# EasyEDA schematic Spring+Schematic_r1.1_easyeda.json
TITLE: Spring+ Avionics Control-Board; REV: 1.1; Date: 2021-11-15; Sheet: 1/1; Company: Lrocket
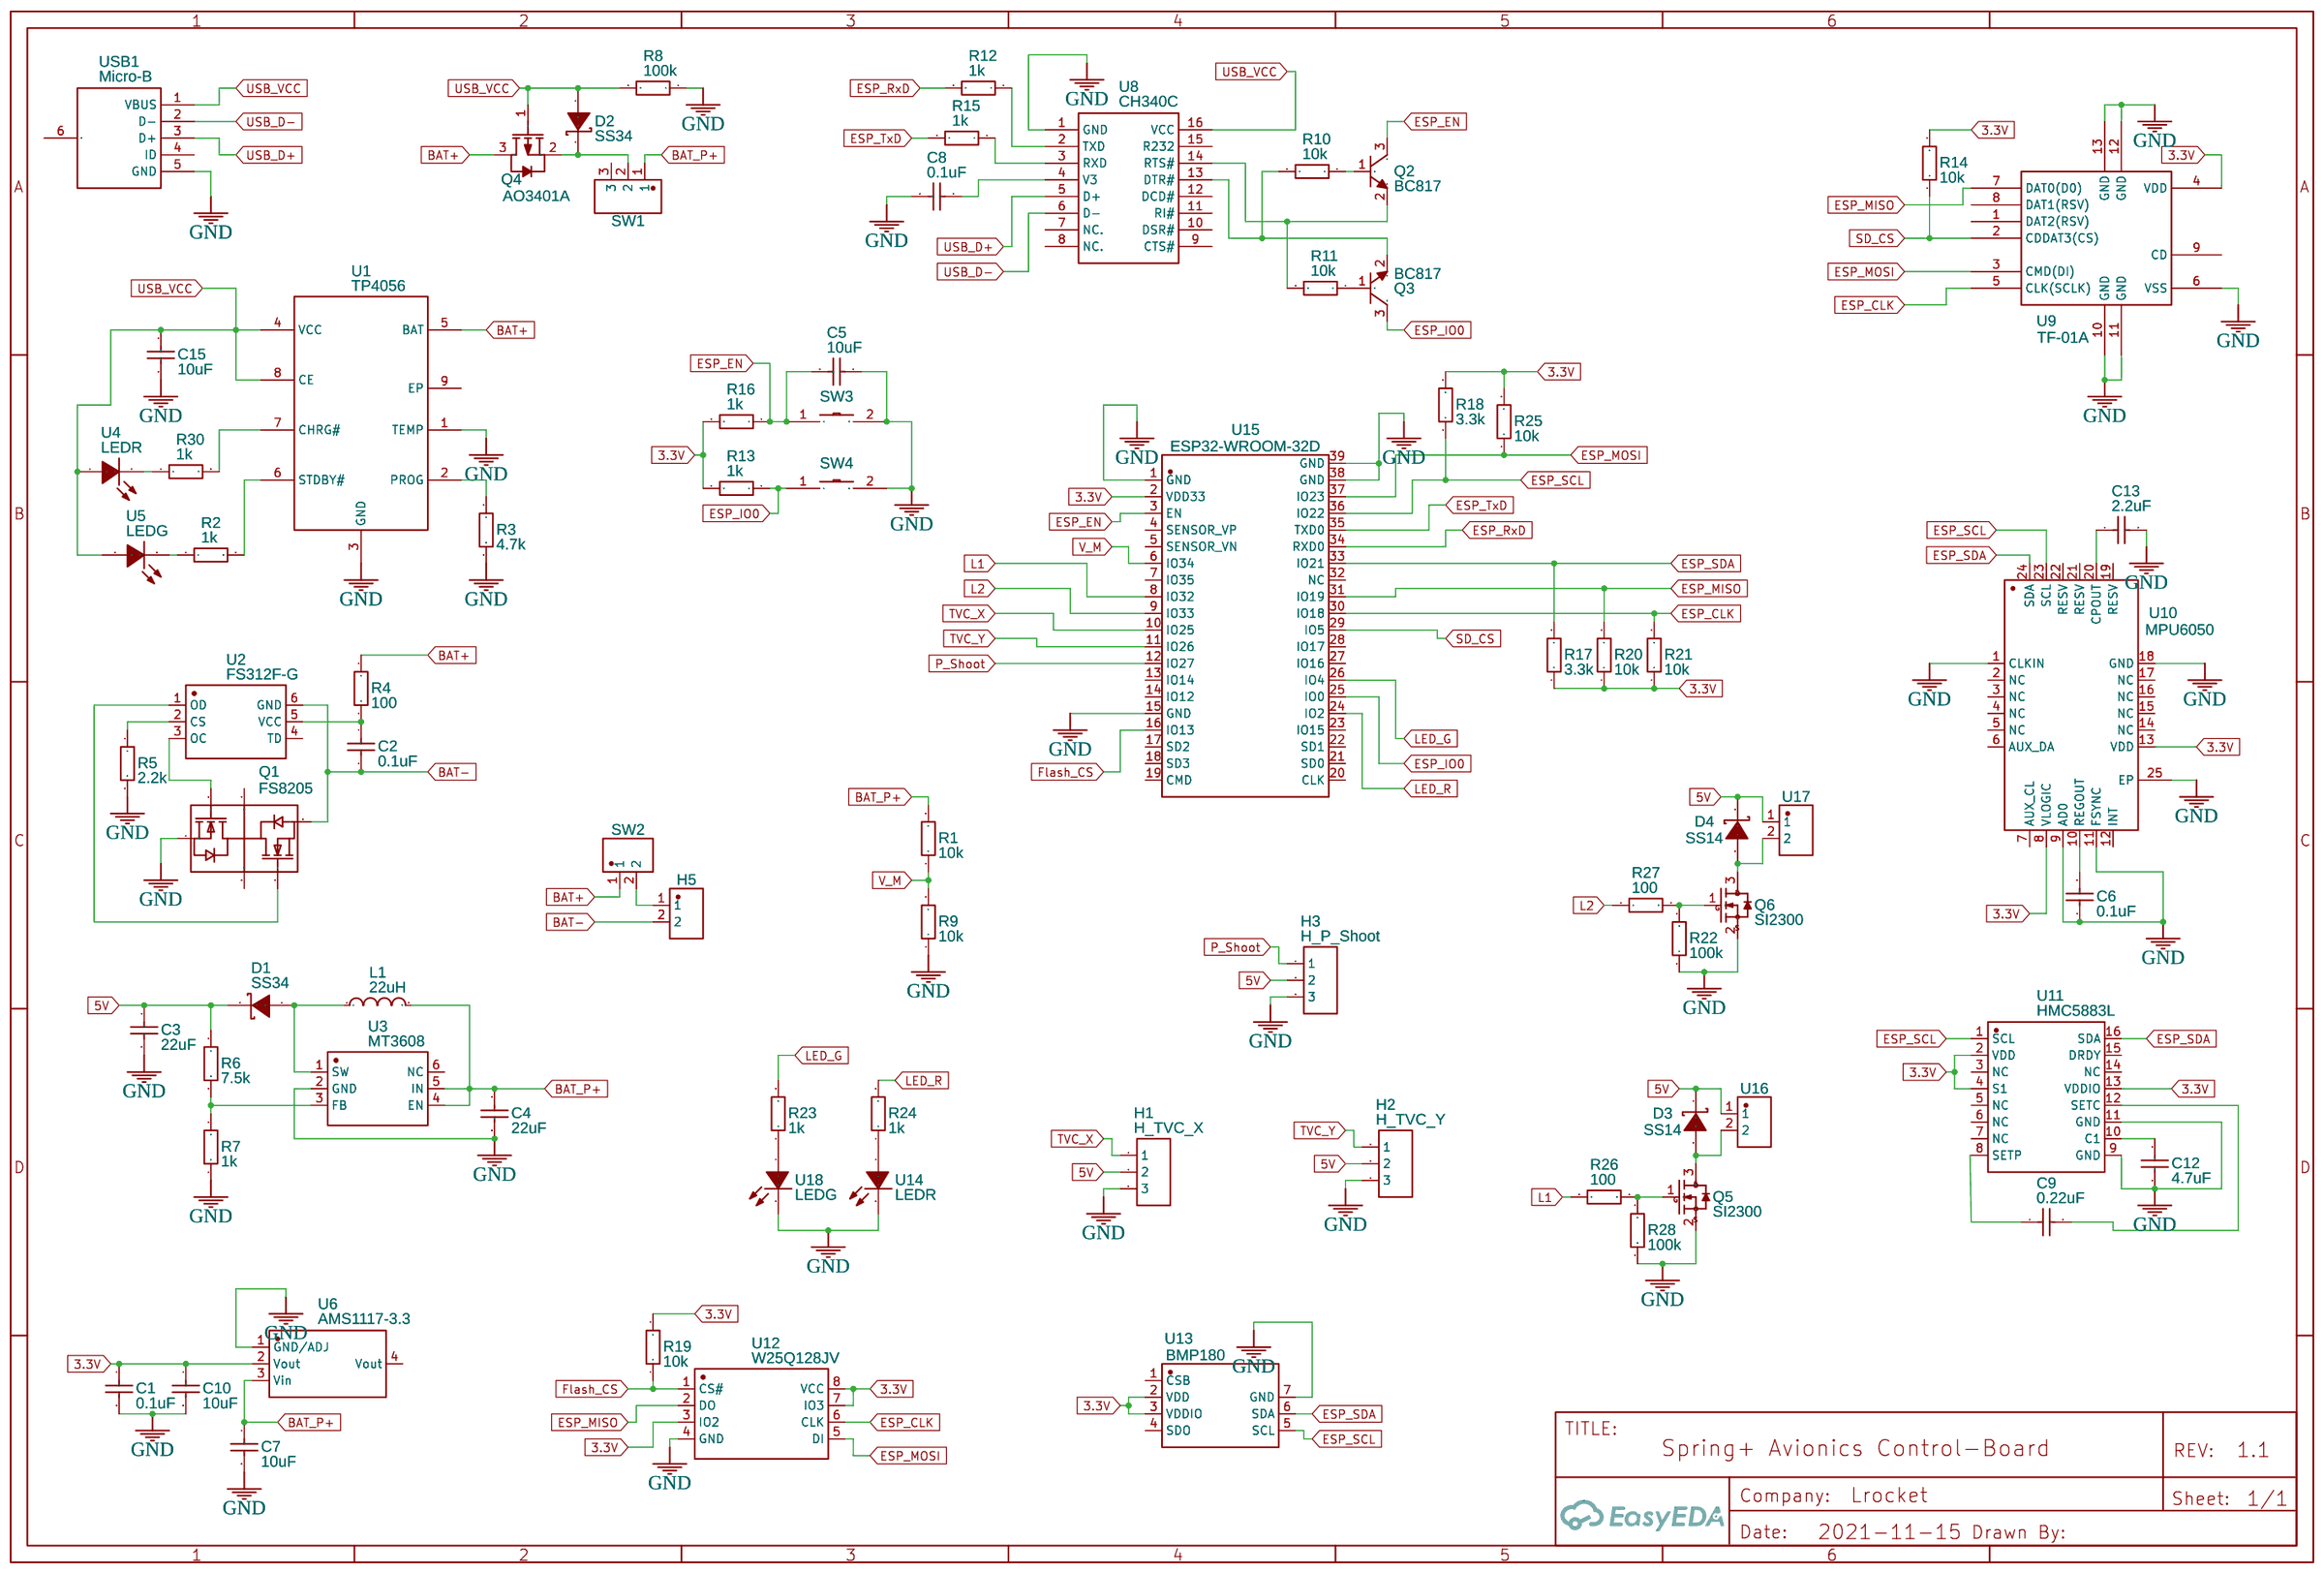
[diagram p0: schematic sheet]

## Parts
C1  0.1uF  [C0603]
C2  0.1uF  [C0603]
C3  22uF  [C0603]
C4  22uF  [C0603]
C5  10uF  [C0603]
C6  0.1uF  [C0603]
C7  10uF  [C0603]
C8  0.1uF  [C0603]
C9  0.22uF  [C0603]
C10  10uF  [C0603]
C12  4.7uF  [C0603]
C13  2.2uF  [C0603]
C15  10uF  [C0603]
D1  SS34  [SMC_L7.1-W6.2-LS8.1-R-RD]
D2  SS34  [SMC_L7.1-W6.2-LS8.1-R-RD]
D3  SS14  [SMA_L4.4-W2.8-LS5.4-RD]
D4  SS14  [SMA_L4.4-W2.8-LS5.4-RD]
H1  H_TVC_X  [HDR-TH_3P-P2.54-V-M-1]
H2  H_TVC_Y  [HDR-TH_3P-P2.54-V-M-1]
H3  H_P_Shoot  [HDR-TH_3P-P2.54-V-M-1]
H5  22-28-4020  [HDR-TH_2P-P2.54-V-M-1]
L1  22uH  [IND-SMD_L7.0-W6.6_FXL0630]
Q1  FS8205  [SOT-23-6_L2.9-W1.6-P0.95-LS2.8-BR]
Q2  BC817  [SOT-23-3_L2.9-W1.6-P1.90-LS2.8-BR]
Q3  BC817  [SOT-23-3_L2.9-W1.6-P1.90-LS2.8-BR]
Q4  AO3401A  [SOT-23_L2.9-W1.3-P1.90-LS2.4-BR]
Q5  SI2300  [SOT-23-3_L2.9-W1.3-P1.90-LS2.4-BR]
Q6  SI2300  [SOT-23-3_L2.9-W1.3-P1.90-LS2.4-BR]
R1  10k  [R0603]
R2  1k  [R0603]
R3  4.7k  [R0603]
R4  100  [R0603]
R5  2.2k  [R0603]
R6  7.5k  [R0603]
R7  1k  [R0603]
R8  100k  [R0603]
R9  10k  [R0603]
R10  10k  [R0603]
R11  10k  [R0603]
R12  1k  [R0603]
R13  1k  [R0603]
R14  10k  [R0603]
R15  1k  [R0603]
R16  1k  [R0603]
R17  3.3k  [R0603]
R18  3.3k  [R0603]
R19  10k  [R0603]
R20  10k  [R0603]
R21  10k  [R0603]
R22  100k  [R0603]
R23  1k  [R0603]
R24  1k  [R0603]
R25  10k  [R0603]
R26  100  [R0603]
R27  100  [R0603]
R28  100k  [R0603]
R30  1k  [R0603]
SW1  X6511WV-03H-C30D60  [HDR-TH_3P-P2.54-V-M]
SW2  22-28-4020  [HDR-TH_2P-P2.54-V-M-1]
SW3  TS-1101-C-W  [SW-SMD_L6.0-W3.3-LS8.0]
SW4  TS-1101-C-W  [SW-SMD_L6.0-W3.3-LS8.0]
U1  TP4056  [ESOP-8_L4.9-W3.9-P1.27-LS6.0-BL-EP]
U2  FS312F-G  [SOT-23-6_L2.9-W1.6-P0.95-LS2.8-BR]
U3  MT3608  [SOT-23-6_L2.9-W1.6-P0.95-LS2.8-BR]
U4  LEDR  [LED0603-R-RD_WHITE]
U5  LEDG  [LED0603-R-RD_WHITE]
U6  AMS1117-3.3  [SOT-223-3_L6.5-W3.4-P2.30-LS7.0-BR]
U8  CH340C  [SOP-16_L10.0-W3.9-P1.27-LS6.0-BL]
U9  TF-01A  [TF-SMD_TF-01A]
U10  MPU6050  [QFN-24_L4.0-W4.0-P0.50-BL-EP2.7]
U11  HMC5883L  [LPCC-16_L3.0-W3.0-P0.50-BL]
U12  W25Q128JV  [SOIC-8_L5.3-W5.3-P1.27-LS8.0-BL]
U13  BMP180  [LGA-7_L3.8-W3.6-P1.50-BL]
U14  LEDR  [LED0603-R-RD_WHITE]
U15  ESP32-WROOM-32D  [WIFIM-SMD_39P-L25.5-W18.0-P1.27-BL]
U16  KF128-5.08-2P  [CONN-TH_P5.08_KF128-5.08-2P]
U17  KF128-5.08-2P  [CONN-TH_P5.08_KF128-5.08-2P]
U18  LEDG  [LED0603-R-RD_WHITE]
USB1  Micro-B  [MICRO-USB-SMD_U254-051T-4BH83-S1S]

## Library data of the parts
C1-C10 C12 C13 C15 = CC0603KRX7R9BB103: Supplier: LCSC; Manufacturer: YAGEO; Supplier Part: C100042; JLCPCB Part Class: Extended Part
D1 D2 = SS34: Supplier: LCSC; Manufacturer: MDD; Supplier Part: C13763; JLCPCB Part Class: Extended Part
D3 D4 = SS14: Supplier: LCSC; Manufacturer: MDD; Supplier Part: C2480; JLCPCB Part Class: Basic Part
H1-H3 = Header-Male-2.54_1x3: Supplier: LCSC; Manufacturer: BOOMELE; Manufacturer Part: Header2.54mm 1*3P; Supplier Part: C49257; JLCPCB Part Class: Extended Part
H5 SW2 = 22-28-4020: Supplier: LCSC; Supplier Part: C234182; Manufacturer: MOLEX; Contributor: LCSC; JLCPCB Part Class: Extended Part
L1 = FXL0630-220-M: Supplier: LCSC; Supplier Part: C177244; Manufacturer: Changjiang Microelectronics Tech; Contributor: LCSC; JLCPCB Part Class: Extended Part
Q1 = FS8205: Supplier: LCSC; Manufacturer: FORTUNE; Supplier Part: C32254; JLCPCB Part Class: Basic Part
Q2 Q3 = BC817-25: Supplier: LCSC; Manufacturer: CJ; Supplier Part: C8588; JLCPCB Part Class: Extended Part
Q4 = AO3401A: Supplier: LCSC; Manufacturer: AOS; Supplier Part: C15127; JLCPCB Part Class: Basic Part
Q5 Q6 = SI2300: Supplier: LCSC; Manufacturer: Hottech; Contributor: LCSC; Supplier Part: C181085; JLCPCB Part Class: Extended Part
R1-R28 R30 = TR0603B10KP05250.1W: Supplier: LCSC; Supplier Part: C188363; Manufacturer: Ever Ohms Tech; Contributor: LCSC
SW1 = X6511WV-03H-C30D60: Supplier: LCSC; Supplier Part: C706875; Manufacturer: XKB Connectivity; Contributor: LCSC; JLCPCB Part Class: Extended Part
SW3 SW4 = TS-1101-C-W: Supplier: LCSC; Supplier Part: C318938; Manufacturer: XKB Connectivity(中国星坤); Contributor: LCSC; JLCPCB Part Class: Extended Part
U1 = TP4056: Contributor: Guest; Supplier: LCSC; Manufacturer: TOPPOWER; Supplier Part: C16581; JLCPCB Part Class: Basic Part
U2 = FS312F-G: Supplier: LCSC; Manufacturer: FORTUNE; Supplier Part: C82736; JLCPCB Part Class: Extended Part
U3 = MT3608: Supplier: LCSC; Manufacturer: AEROSEMI; Supplier Part: C84817; JLCPCB Part Class: Extended Part
U4 U5 U14 U18 = SZYY0603W: Supplier: LCSC; Supplier Part: C434422; Manufacturer: Yongyu Photoelectric; Contributor: LCSC; JLCPCB Part Class: Extended Part
U6 = AMS1117-3.3: sourceId: dwIGgezVh; Supplier: LCSC; Manufacturer: AMS; Supplier Part: C6186; JLCPCB Part Class: Basic Part
U8 = CH340C: Supplier: LCSC; Manufacturer: WCH; Supplier Part: C84681; JLCPCB Part Class: Extended Part
U9 = TF-01A: Supplier: LCSC; Manufacturer: HRO; Supplier Part: C91145; JLCPCB Part Class: Extended Part
U10 = MPU6050-YJLTY: Supplier: LCSC; Supplier Part: C2912107; Manufacturer: null; JLCPCB Part Class: Extended Part; Contributor: LCSC
U11 = HMC5883L: Supplier: LCSC; Supplier Part: C2859540; Manufacturer: null; JLCPCB Part Class: Extended Part; Contributor: LCSC
U12 = W25Q128JVSIQTR: Supplier: LCSC; Manufacturer: WINBOND; Supplier Part: C97521; JLCPCB Part Class: Basic Part
U13 = BMP180: Supplier: LCSC; Supplier Part: C438474; Manufacturer: Bosch Sensortec; Contributor: LCSC; JLCPCB Part Class: Extended Part
U15 = ESP32-WROOM-32D: Supplier: LCSC; Supplier Part: C473012; Manufacturer: ESPRESSIF 乐鑫; Contributor: LCSC; JLCPCB Part Class: Extended Part
U16 U17 = KF128-5.08-2P: Supplier: LCSC; Supplier Part: C474952; Manufacturer: Cixi Kefa Elec; Contributor: LCSC; JLCPCB Part Class: Extended Part
USB1 = U254-051T-4BH83-S1S: Supplier: LCSC; Supplier Part: C319160; Manufacturer: XKB Enterprise; Contributor: LCSC; JLCPCB Part Class: Extended Part

## Nets
3.3V: C1.1 C10.1 R13.2 R14.2 R16.2 R17.1 R18.2 R19.2 R20.1 R21.1 R25.2 U6.2(Vout) U9.4(VDD) U10.8(VLOGIC) U10.13(VDD) U11.2(VDD) U11.4(S1) U11.13(VDDIO) U12.3(IO2) U12.7(IO3) U12.8(VCC) U13.2(VDD) U13.3(VDDIO) U15.2(VDD33)
5V: C3.1 D1.2(K) D3.1(K) D4.1(K) H1.2 H2.2 H3.2 R6.1 U16.1 U17.1
GND: C1.2 C3.2 C4.2 C5.1 C6.1 C7.2 C8.2 C10.2 C12.2 C13.2 C15.2 H1.3 H2.3 H3.3 Q1.1(S1) Q5.2(S) Q6.2(S) R3.2 R5.2 R7.2 R8.1 R9.1 R22.1 R28.1 SW3.2 SW4.2 U1.1(TEMP) U1.3(GND) U3.2(GND) U6.1(GND/ADJ) U8.1(GND) U9.6(VSS) U9.10(GND) U9.11(GND) U9.12(GND) U9.13(GND) U10.1(CLKIN) U10.9(AD0) U10.11(FSYNC) U10.18(GND) U10.25(EP) U11.9(GND) U11.11(GND) U12.4(GND) U13.7(GND) U14.2(-) U15.1(GND) U15.15(GND) U15.38(GND) U15.39(GND) U18.2(-) USB1.5(GND)
BAT+: Q4.3(D) R4.1 SW2.1 U1.5(BAT)
BAT-: C2.2 H5.2 Q1.3(S2) U2.6(GND)
BAT_P+: C4.1 C7.1 L1.2 R1.2 SW1.1 U3.4(EN) U3.5(IN) U6.3(Vin)
ESP_CLK: R21.2 U9.5(CLK(SCLK)) U12.6(CLK) U15.30(IO18)
ESP_EN: C5.2 Q2.3(C) R16.1 SW3.1 U15.3(EN)
ESP_IO0: Q3.3(C) R13.1 SW4.1 U15.25(IO0)
ESP_MISO: R20.2 U9.7(DAT0(D0)) U12.2(DO) U15.31(IO19)
ESP_MOSI: R25.1 U9.3(CMD(DI)) U12.5(DI) U15.37(IO23)
ESP_RxD: R12.2 U15.34(RXD0)
ESP_SCL: R18.1 U10.23(SCL) U11.1(SCL) U13.5(SCL) U15.36(IO22)
ESP_SDA: R17.2 U10.24(SDA) U11.16(SDA) U13.6(SDA) U15.33(IO21)
ESP_TxD: R15.2 U15.35(TXD0)
Flash_CS: R19.1 U12.1(CS#) U15.16(IO13)
L1: R26.1 U15.8(IO32)
L2: R27.1 U15.9(IO33)
LED_G: R23.2 U15.26(IO4)
LED_R: R24.2 U15.24(IO2)
P_Shoot: H3.1 U15.12(IO27)
SD_CS: R14.1 U9.2(CDDAT3(CS)) U15.29(IO5)
TVC_X: H1.1 U15.10(IO25)
TVC_Y: H2.1 U15.11(IO26)
USB_D+: U8.5(D+) USB1.3(D+)
USB_D-: U8.6(D-) USB1.2(D-)
USB_VCC: C15.1 D2.1(A) Q4.1(G) R8.2 U1.4(VCC) U1.8(CE) U4.1(+) U5.1(+) U8.16(VCC) USB1.1(VBUS)
V_M: R1.1 R9.2 U15.6(IO34)
Net-(C2-1): C2.1 R4.2 U2.5(VCC)
Net-(C6-2): C6.2 U10.10(REGOUT)
Net-(C8-1): C8.1 U8.4(V3)
Net-(C9-1): C9.1 U11.8(SETP)
Net-(C9-2): C9.2 U11.12(SETC)
Net-(C12-1): C12.1 U11.10(C1)
Net-(C13-1): C13.1 U10.20(CPOUT)
Net-(D1-1): D1.1(A) L1.1 U3.1(SW)
Net-(D2-2): D2.2(K) Q4.2(S) SW1.2
Net-(D3-2): D3.2(A) Q5.3(D) U16.2
Net-(D4-2): D4.2(A) Q6.3(D) U17.2
Net-(H5-1): H5.1 SW2.2
Net-(Q1-4): Q1.4(G2) U2.1(OD)
Net-(Q1-6): Q1.6(G1) U2.3(OC)
Net-(Q2-1): Q2.1(B) R10.1
Net-(Q2-2): Q2.2(E) R11.2 U8.14(RTS#)
Net-(Q3-1): Q3.1(B) R11.1
Net-(Q3-2): Q3.2(E) R10.2 U8.13(DTR#)
Net-(Q5-1): Q5.1(G) R26.2 R28.2
Net-(Q6-1): Q6.1(G) R22.2 R27.2
Net-(R2-1): R2.1 U5.2(-)
Net-(R2-2): R2.2 U1.6(STDBY#)
Net-(R3-1): R3.1 U1.2(PROG)
Net-(R5-1): R5.1 U2.2(CS)
Net-(R6-2): R6.2 R7.1 U3.3(FB)
Net-(R12-1): R12.1 U8.2(TXD)
Net-(R15-1): R15.1 U8.3(RXD)
Net-(R23-1): R23.1 U18.1(+)
Net-(R24-1): R24.1 U14.1(+)
Net-(R30-1): R30.1 U4.2(-)
Net-(R30-2): R30.2 U1.7(CHRG#)

Not connected (* = marked no-connect by the designer): Q1 2(D12) 5(D12); SW1 3; U1 9(EP); U2 4(TD); U3 6(NC); U6 4(Vout); U8 7(NC.) 8(NC.) 9(CTS#) 10(DSR#) 11(RI#) 12(DCD#) 15(R232); U9 1(DAT2(RSV)) 8(DAT1(RSV)) 9(CD); U10 2(NC) 3(NC) 4(NC) 5(NC) 6(AUX_DA) 7(AUX_CL) 12(INT) 14(NC) 15(NC) 16(NC) 17(NC) 19(RESV) 21(RESV) 22(RESV); U11 3(NC) 5(NC) 6(NC) 7(NC) 14(NC) 15(DRDY); U13 1(CSB) 4(SDO); U15 4(SENSOR_VP) 5(SENSOR_VN) 7(IO35) 13(IO14) 14(IO12) 17(SD2) 18(SD3) 19(CMD) 20(CLK) 21(SD0) 22(SD1) 23(IO15) 27(IO16) 28(IO17) 32(NC); USB1 4(ID) 6(EH)
